# Altium schematic sheet PFC_PWR_BOOST_CNV.SchDoc
size A4; SheetNumber: 5; SheetTotal: 8
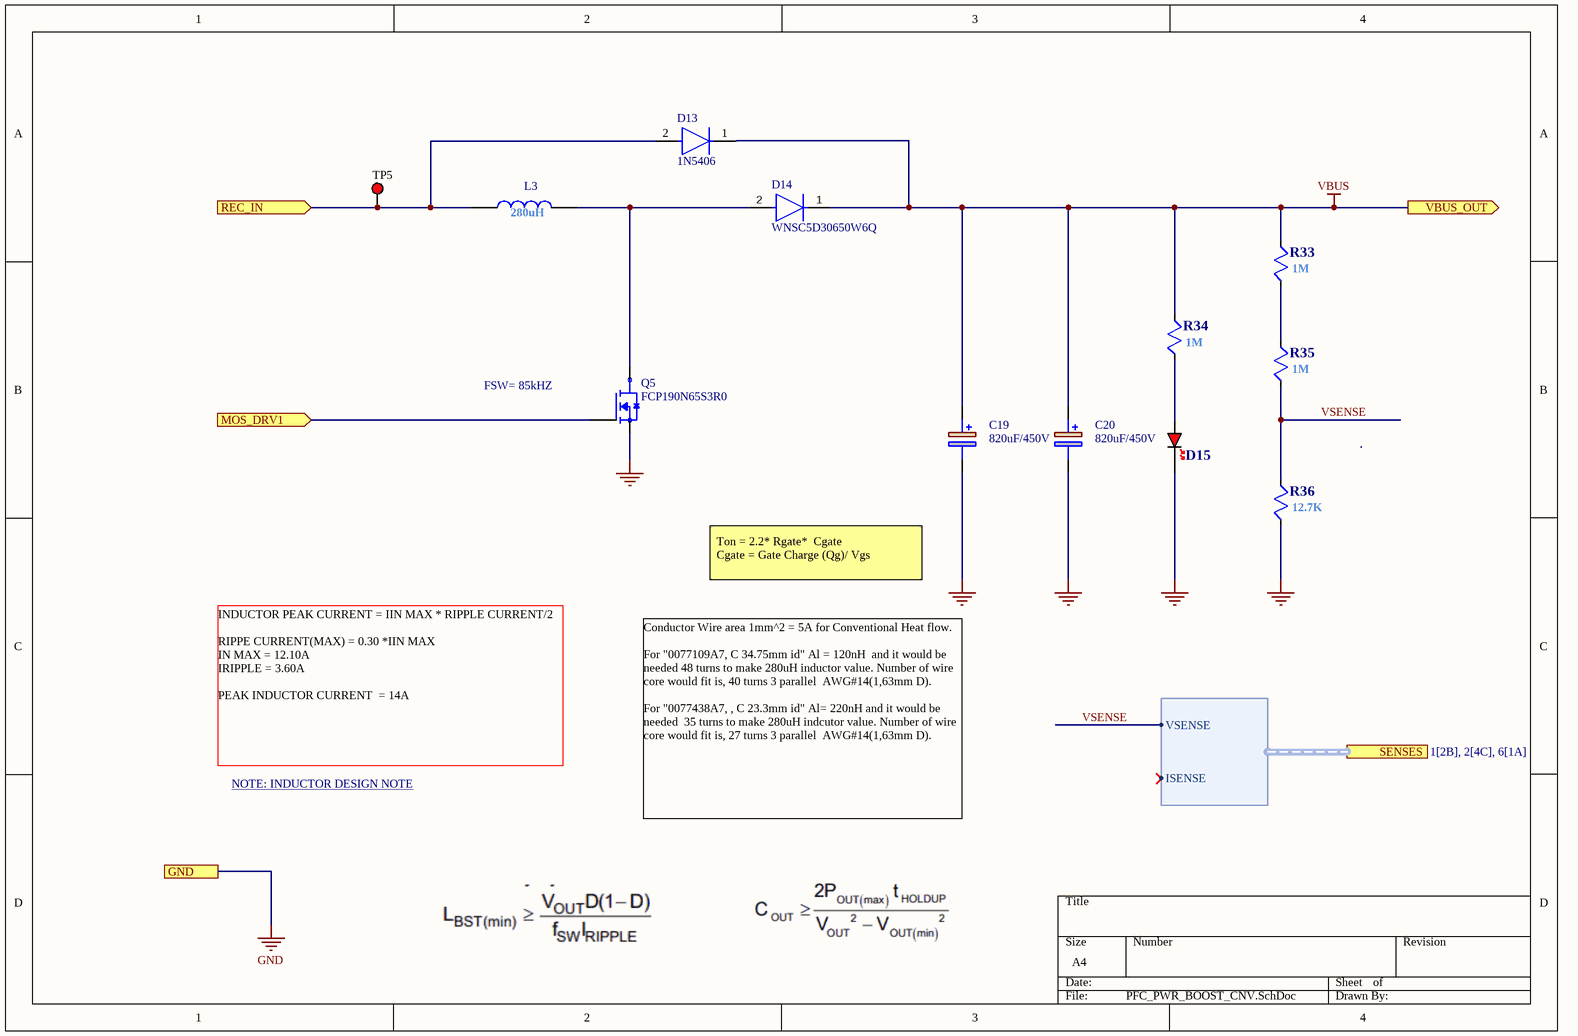
[diagram p0: PFC_PWR_BOOST_CNV.SchDoc]

## Parts
C19  value 820uF/450V  [CAPPRD1000W180D3550H5250]  (hidden comment: ESMR451VSN821MA50S)
C20  value 820uF/450V  [CAPPRD1000W180D3550H5250]  (hidden comment: ESMR451VSN821MA50S)
D13  1N5406  [FP-1N5406-E3-54-MFG]
D14  WNSC5D30650W6Q  [WNSC5D30650W6Q]
D15  19-21/R6C-AP1Q2/4T  [LED_0603_RED]  (value not drawn)
L3  value 280uH  [0077438A7]  (hidden comment: 0077438A7)
Q5  FCP190N65S3R0  [Mosfet_T0220]
R33  value 1M  [RESC1608N]  (hidden comment: 0603SAJ0105TDE)
R34  value 1M  [RESC1608N]  (hidden comment: 0603SAJ0105TDE)
R35  value 1M  [RESC1608N]  (hidden comment: 0603SAJ0105TDE)
R36  value 12.7K  [RESC1608N]  (hidden comment: CR-03FA7--12K7)
TP5  5010  [KSTN-5010_V]  (value not drawn)

## Ports
GND (see 1[2A], 2[1D], 3[1D], 4[4C], 6[1C], 7[1C], 8[1C]), MOS_DRV1 (in, see 1[3B], 7[4B]), REC_IN (in, see 1[2A]), SENSES (harness SENSES, see 1[2B], 2[4C], 6[1A]), VBUS_OUT (out, see 1[3A])

## Harnesses
SENSES: ISENSE, VSENSE

## Nets
GND: C19.2(-) C20.2(-) D15.K Q5.3(S) R36.2 ; port GND
VBUS: C19.1(+) C20.1(+) D13.1(C) D14.1(K) R33.1 R34.1 ; port VBUS_OUT
MOS_DRV1: Q5.1(G) ; port MOS_DRV1
REC_IN: D13.2(A) L3.1 TP5.1 ; port REC_IN
VSENSE: R35.2 R36.1 ; port SENSES.VSENSE
NetD14_2: D14.2(A) L3.2 Q5.2(D)
NetD15_A: D15.A R34.2
NetR33_2: R33.2 R35.1

## Notes on the sheet
- FSW= 85kHZ
- Ton = 2.2* Rgate*  Cgate
  Cgate = Gate Charge (Qg)/ Vgs
- INDUCTOR PEAK CURRENT = IIN MAX * RIPPLE CURRENT/2
  RIPPE CURRENT(MAX) = 0.30 *IIN MAX
  IN MAX = 12.10A
  IRIPPLE = 3.60A
  PEAK INDUCTOR CURRENT  = 14A
- NOTE: INDUCTOR DESIGN NOTE <https://www.micrometals.com/design-and-applications/design-tools/inductor-designer/>
- Conductor Wire area 1mm^2 = 5A for Conventional Heat flow.
  For "0077109A7, C 34.75mm id" Al = 120nH  and it would be needed 48 turns to make 280uH inductor value. Number of wire core would fit is, 40 turns 3 parallel  AWG#14(1,63mm D).
  For "0077438A7, , C 23.3mm id" Al= 220nH and it would be needed  35 turns to make 280uH indcutor value. Number of wire core would fit is, 27 turns 3 parallel  AWG#14(1,63mm D).

## Library data of the parts
C19 C20 = ESMR451VSN821MA50S: Aluminum Electrolytic Capacitors - Snap In 450V 820uF 20% Tol.; Manufacturer_Name: Chemi-Con; Geometry.Height: 52.5mm; Mouser Part Number: 661-ESMR451N821MA50S; Mouser Price/Stock: https://www.mouser.co.uk/ProductDetail/United-Chemi-Con/ESMR451VSN821MA50S/?qs=Odivq8ja527O2dyonXL23g%3D%3D; Manufacturer_Part_Number: ESMR451VSN821MA50S; Datasheet Link: https://www.chemi-con.co.jp/products/relatedfiles/capacitor/catalog/SMRN-e.PDF
D13 = CMP-02540-000085-1: DIODE GEN PURP 600V 3A DO201AD
D14 = WNSC5D30650W6Q: DIODE SIL.CARB.SCHOTTKY 30A 650V TO247F-2L THT
D15 = LED_0603_RED: LED SMD 0603 RED 28.5-72mcd 100° WATER CLEAR
L3 = 0077438A7: Coated Kool Mu Ferrite Core Toroid Type Length Width 1.875" (47.63mm) Diameter 0.745" (18.92mm) Height
Q5 = Mosfet_TO220: MOSFET DIS.17A 650V N-CH TO220-3; RS Part Number: *; RS Stock/Price: *; Manufacturer_Name: *; Manufacturer_Part_Number: *; Datasheet Link: *
R33-R35 = RES: RES.(1608) 0603 1M Ohms 5% 1/10W-S 100PPM
R36 = RES: RES.(1608) 0603 12.7K Ohms 1% 1/4W 100PPM
TP5 = CMP-1672-00002-4: Test Point, Red, Through Hole, RoHS, Bulk; Manufacturer: Keystone; Contact Material: Bronze; Mounting Technology: Through Hole; RoHSCompliant: true; Pins: 1; Package Quantity: 100; ComponentLink2Description: Datasheet; Height: 8.12 mm; ComponentLink1URL: http://www.keyelco.com/; DatasheetVersion: Rev. F, 12/2013; Mount: Through Hole; PackageReference: 5010; Contact Plating: Silver; Packaging: Bulk; Colour: Red; REACH SVHC: No SVHC; PackageDescription: 1-Pin Through Hole Device, Dia 3.17 mm; ComponentLink2URL: http://www.keyelco.com/product-pdf.cfm?p=1319; ComponentLink1Description: Manufacturer URL